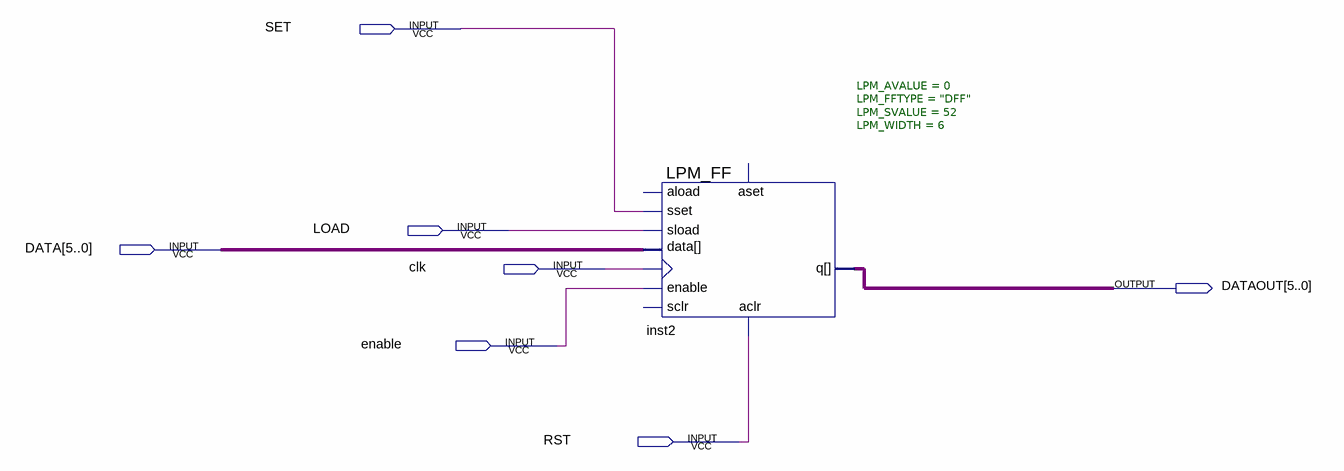
[diagram p0: schematic sheet]
// Quartus schematic g54_LPM_FF_TEST.bdf as structural Verilog: 1 symbols, 7 pins
module g54_LPM_FF_TEST (
  input  SET,
  input  LOAD,
  input  [5:0] DATA,
  input  clk,
  input  enable,
  input  RST,
  output [5:0] DATAOUT
);

  LPM_FF #(.LPM_AVALUE(0), .LPM_FFTYPE("DFF"), .LPM_SVALUE(52), .LPM_WIDTH(6)) inst2 (
    .enable(enable), .clock(clk), .sset(SET), .sload(LOAD), .aclr(RST), .data(DATA), .q(DATAOUT));  // open: aload, aset, sclr
endmodule
